# Altium schematic sheet low-pass-fitler.SchDoc
size A4; SheetNumber: 3; SheetTotal: 7
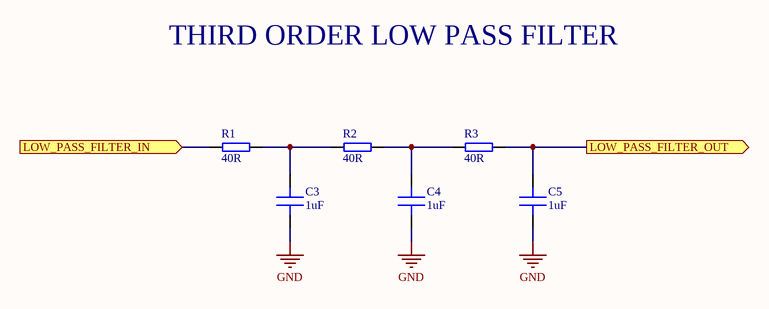
[diagram p0: low-pass-fitler.SchDoc]

## Parts
C3  1uF  [C 0402]
C4  1uF  [C 0402]
C5  1uF  [C 0402]
R1  40R  [R 0402]
R2  40R  [R 0402]
R3  40R  [R 0402]

## Ports
LOW_PASS_FILTER_IN (in), LOW_PASS_FILTER_OUT (out)

## Nets
GND: C3.2 C4.2 C5.2
LOW_PASS_FILTER_IN: R1.1 ; port LOW_PASS_FILTER_IN
LOW_PASS_FILTER_OUT: C5.1 R3.2 ; port LOW_PASS_FILTER_OUT
NetC3_1: C3.1 R1.2 R2.1
NetC4_1: C4.1 R2.2 R3.1

## Notes on the sheet
- THIRD ORDER LOW PASS FILTER

## Library data of the parts
C3-C5 = Capacitor: MLCC Capacitor
R1-R3 = Resistor: General pourpouse resistor